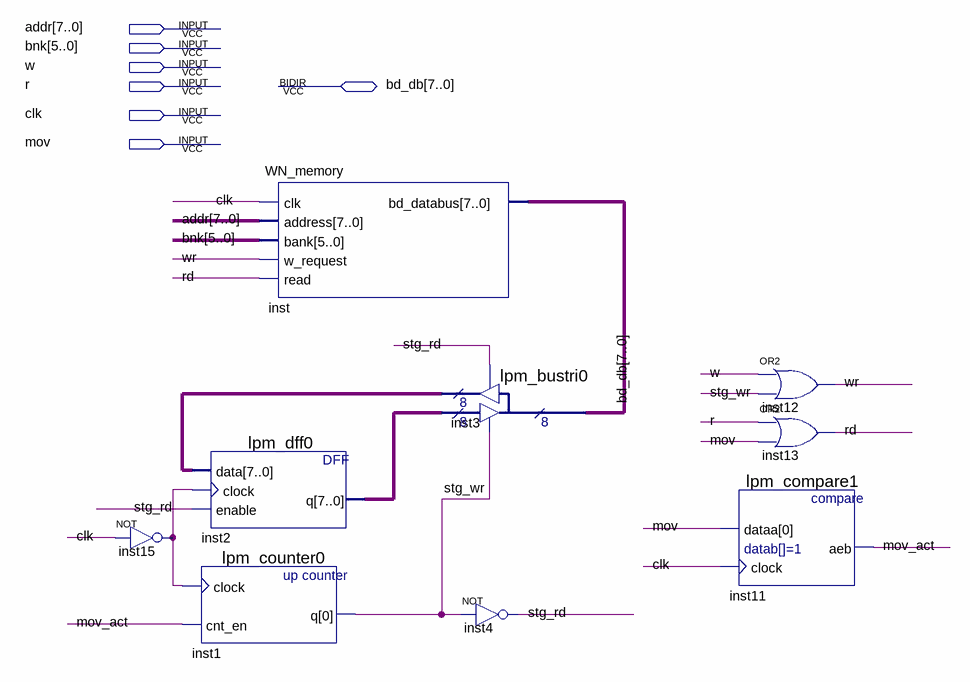
[diagram p0: schematic sheet]
// Quartus schematic WN_memory_operations.bdf as structural Verilog: 9 symbols, 7 pins
module WN_memory_operations (
  input  [7:0] addr,
  input  [5:0] bnk,
  input  w,
  input  r,
  input  clk,
  input  mov,
  inout  [7:0] bd_db
);

  wire inst15_out, mov_act, rd, stg_rd, stg_wr, wr;
  wire [7:0] inst2_q, inst3_result;

  not inst15 (inst15_out, clk);
  lpm_dff0 inst2 (.data(inst3_result), .clock(inst15_out), .enable(stg_rd), .q(inst2_q));
  lpm_counter0 inst1 (.clock(inst15_out), .cnt_en(mov_act), .q(stg_wr));
  WN_memory inst (.clk(clk), .address(addr), .bank(bnk), .w_request(wr), .read(rd), .bd_databus(bd_db));
  lpm_bustri0 inst3 (.enabledt(stg_wr), .data(inst2_q), .enabletr(stg_rd), .result(inst3_result), .tridata(bd_db));
  not inst4 (stg_rd, stg_wr);
  lpm_compare1 inst11 (.dataa(mov), .clock(clk), .aeb(mov_act));
  or inst12 (wr, w, stg_wr);
  or inst13 (rd, r, mov);
endmodule
